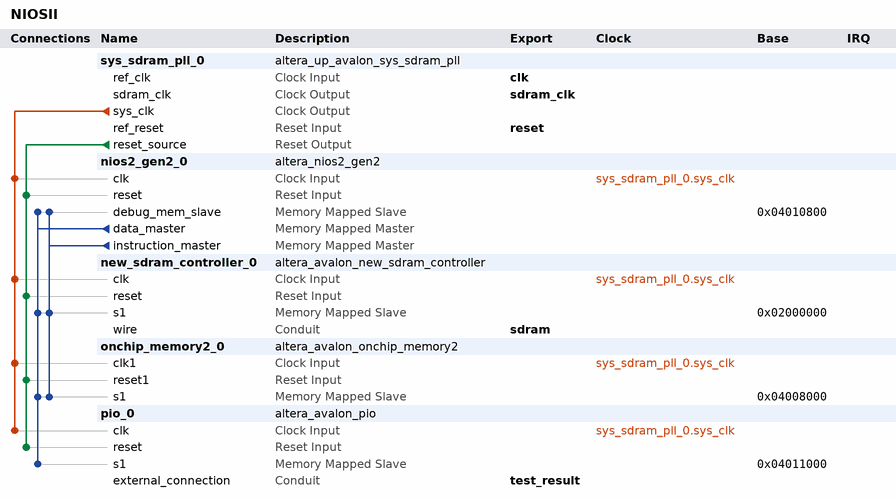
[diagram p0: system contents]
# Platform Designer (Qsys) system NIOSII, Cyclone IV E EP4CE10E22C7
# Parameters at their usual value, and those the tool derives, are not listed.
package require -exact qsys 17.1
create_system NIOSII
set_project_property DEVICE_FAMILY {Cyclone IV E}
set_project_property DEVICE EP4CE10E22C7

add_instance sys_sdram_pll_0 altera_up_avalon_sys_sdram_pll 17.1
set_instance_parameter_value sys_sdram_pll_0 CIV_boards DE0-Nano
set_instance_parameter_value sys_sdram_pll_0 CV_boards DE10-Standard
set_instance_parameter_value sys_sdram_pll_0 gui_outclk 50.0
set_instance_parameter_value sys_sdram_pll_0 gui_refclk 50.0

add_instance nios2_gen2_0 altera_nios2_gen2 17.1
set_instance_parameter_value nios2_gen2_0 dcache_size 2048
set_instance_parameter_value nios2_gen2_0 exceptionSlave onchip_memory2_0.s1
set_instance_parameter_value nios2_gen2_0 icache_size 4096
set_instance_parameter_value nios2_gen2_0 impl Fast
set_instance_parameter_value nios2_gen2_0 resetSlave onchip_memory2_0.s1

add_instance new_sdram_controller_0 altera_avalon_new_sdram_controller 17.1
set_instance_parameter_value new_sdram_controller_0 TAC 5.5
set_instance_parameter_value new_sdram_controller_0 TRCD 20.0
set_instance_parameter_value new_sdram_controller_0 TRP 20.0
set_instance_parameter_value new_sdram_controller_0 casLatency 3
set_instance_parameter_value new_sdram_controller_0 columnWidth 9
set_instance_parameter_value new_sdram_controller_0 dataWidth 16
set_instance_parameter_value new_sdram_controller_0 generateSimulationModel false
set_instance_parameter_value new_sdram_controller_0 model single_Micron_MT48LC4M32B2_7_chip
set_instance_parameter_value new_sdram_controller_0 numberOfBanks 4
set_instance_parameter_value new_sdram_controller_0 numberOfChipSelects 1
set_instance_parameter_value new_sdram_controller_0 powerUpDelay 100.0
set_instance_parameter_value new_sdram_controller_0 refreshPeriod 15.625
set_instance_parameter_value new_sdram_controller_0 rowWidth 13

add_instance onchip_memory2_0 altera_avalon_onchip_memory2 17.1
set_instance_parameter_value onchip_memory2_0 dataWidth 32
set_instance_parameter_value onchip_memory2_0 dualPort false
set_instance_parameter_value onchip_memory2_0 initMemContent true
set_instance_parameter_value onchip_memory2_0 initializationFileName firmware.hex
set_instance_parameter_value onchip_memory2_0 memorySize 32768
set_instance_parameter_value onchip_memory2_0 useNonDefaultInitFile true

add_instance pio_0 altera_avalon_pio 17.1
set_instance_parameter_value pio_0 bitModifyingOutReg true
set_instance_parameter_value pio_0 direction Output
set_instance_parameter_value pio_0 width 2

# connections
add_connection sys_sdram_pll_0.sys_clk new_sdram_controller_0.clk clock
add_connection sys_sdram_pll_0.sys_clk nios2_gen2_0.clk clock
add_connection sys_sdram_pll_0.sys_clk onchip_memory2_0.clk1 clock
add_connection sys_sdram_pll_0.sys_clk pio_0.clk clock
add_connection sys_sdram_pll_0.reset_source new_sdram_controller_0.reset reset
add_connection sys_sdram_pll_0.reset_source nios2_gen2_0.reset reset
add_connection sys_sdram_pll_0.reset_source onchip_memory2_0.reset1 reset
add_connection sys_sdram_pll_0.reset_source pio_0.reset reset
add_connection nios2_gen2_0.data_master new_sdram_controller_0.s1 avalon
set_connection_parameter_value nios2_gen2_0.data_master/new_sdram_controller_0.s1 baseAddress 0x02000000
add_connection nios2_gen2_0.data_master nios2_gen2_0.debug_mem_slave avalon
set_connection_parameter_value nios2_gen2_0.data_master/nios2_gen2_0.debug_mem_slave baseAddress 0x04010800
add_connection nios2_gen2_0.data_master onchip_memory2_0.s1 avalon
set_connection_parameter_value nios2_gen2_0.data_master/onchip_memory2_0.s1 baseAddress 0x04008000
add_connection nios2_gen2_0.data_master pio_0.s1 avalon
set_connection_parameter_value nios2_gen2_0.data_master/pio_0.s1 baseAddress 0x04011000
add_connection nios2_gen2_0.instruction_master new_sdram_controller_0.s1 avalon
set_connection_parameter_value nios2_gen2_0.instruction_master/new_sdram_controller_0.s1 baseAddress 0x02000000
add_connection nios2_gen2_0.instruction_master nios2_gen2_0.debug_mem_slave avalon
set_connection_parameter_value nios2_gen2_0.instruction_master/nios2_gen2_0.debug_mem_slave baseAddress 0x04010800
add_connection nios2_gen2_0.instruction_master onchip_memory2_0.s1 avalon
set_connection_parameter_value nios2_gen2_0.instruction_master/onchip_memory2_0.s1 baseAddress 0x04008000

# exported interfaces
add_interface clk clock sink
set_interface_property clk EXPORT_OF sys_sdram_pll_0.ref_clk
add_interface reset reset sink
set_interface_property reset EXPORT_OF sys_sdram_pll_0.ref_reset
add_interface sdram conduit end
set_interface_property sdram EXPORT_OF new_sdram_controller_0.wire
add_interface sdram_clk clock source
set_interface_property sdram_clk EXPORT_OF sys_sdram_pll_0.sdram_clk
add_interface test_result conduit end
set_interface_property test_result EXPORT_OF pio_0.external_connection

set_interconnect_requirement {$system} qsys_mm.clockCrossingAdapter HANDSHAKE
set_interconnect_requirement {$system} qsys_mm.enableEccProtection FALSE
set_interconnect_requirement {$system} qsys_mm.insertDefaultSlave FALSE
set_interconnect_requirement {$system} qsys_mm.maxAdditionalLatency 1

save_system NIOSII.qsys
